# EAGLE design esp-core (EAGLE 7.3.0)
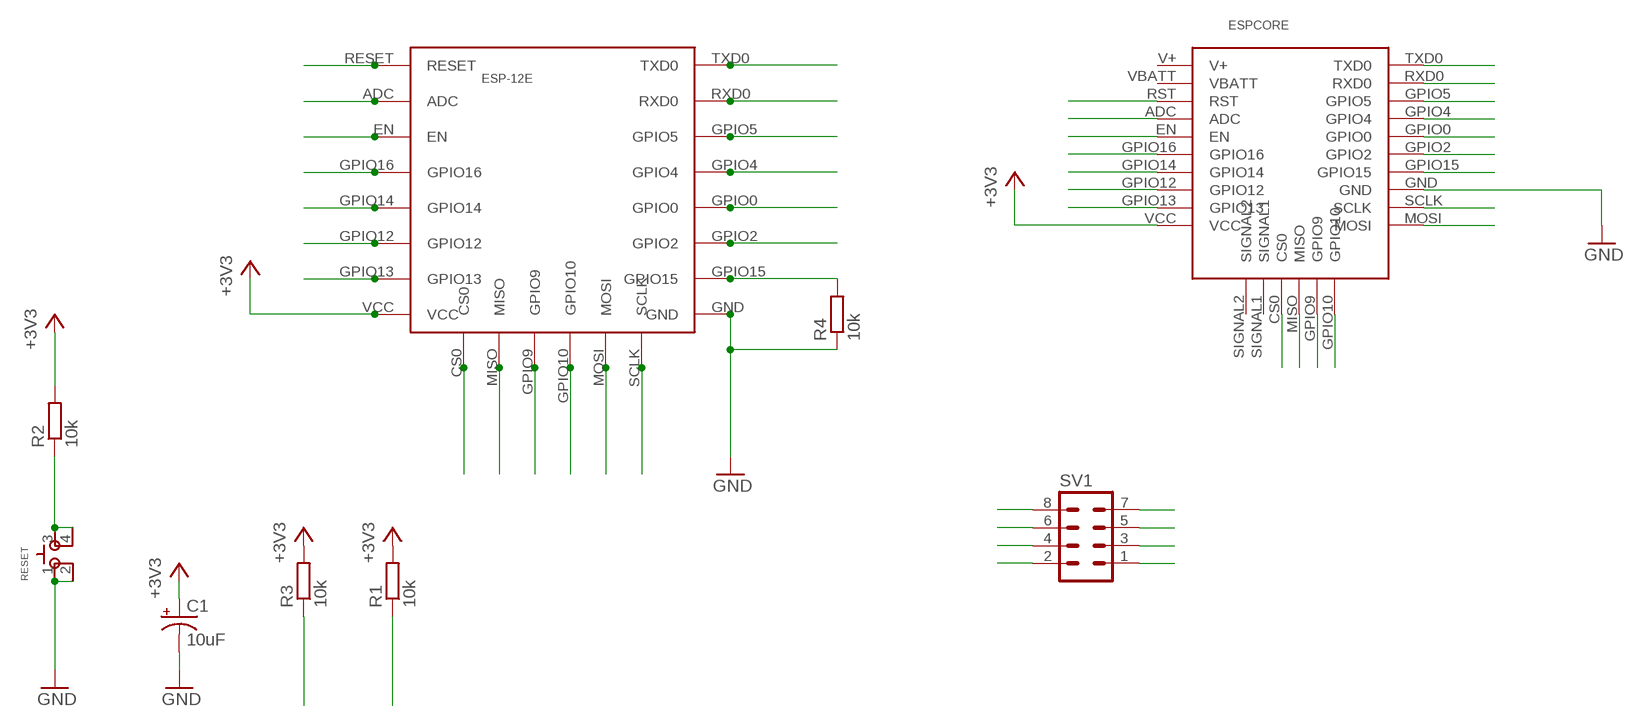
[diagram p0: schematic, sheet 1]

## Parts
C1  10uF  10UF-16V-10%(TANT)  [EIA3216]
ESP-12E  ESP-12E  [ESP-12E]
ESPCORE  ESP-BOARD  [ESP-BOARD]
R1  10k  RESISTOR-1206  [R1206]
R2  10k  RESISTOR-1206  [R1206]
R3  10k  RESISTOR-1206  [R1206]
R4  10k  RESISTOR-1206  [R1206]
RESET  SKSCLDE010  [SKSCLDE010]
SV1  MA04-2  [MA04-2]

## Nets
+3V3: C1.A(+) ESP-12E.VCC ESPCORE.VCC R1.2 R2.2 R3.2 SV1.7
ADC: ESP-12E.ADC ESPCORE.ADC
CS0: ESP-12E.CS0 ESPCORE.CS0
EN: ESP-12E.EN ESPCORE.EN R1.1 SV1.3
GND: C1.C(-) ESP-12E.GND ESPCORE.GND R4.1 RESET.1 RESET.2 SV1.2
GPIO0: ESP-12E.GPIO0 ESPCORE.GPIO0 R3.1 SV1.6
GPIO2: ESP-12E.GPIO2 ESPCORE.GPIO2 SV1.4
GPIO4: ESP-12E.GPIO4 ESPCORE.GPIO4
GPIO5: ESP-12E.GPIO5 ESPCORE.GPIO5
GPIO9: ESP-12E.GPIO9 ESPCORE.GPIO9
GPIO10: ESP-12E.GPIO10 ESPCORE.GPIO10
GPIO12: ESP-12E.GPIO12 ESPCORE.GPIO12
GPIO13: ESP-12E.GPIO13 ESPCORE.GPIO13
GPIO14: ESP-12E.GPIO14 ESPCORE.GPIO14
GPIO15: ESP-12E.GPIO15 ESPCORE.GPIO15 R4.2
GPIO16: ESP-12E.GPIO16 ESPCORE.GPIO16
MISO: ESP-12E.MISO ESPCORE.MISO
MOSI: ESP-12E.MOSI ESPCORE.MOSI
RESET: ESP-12E.RESET ESPCORE.RST R2.1 RESET.3 RESET.4 SV1.5
RXD0: ESP-12E.RXD0 ESPCORE.RXD0 SV1.8
SCLK: ESP-12E.SCLK ESPCORE.SCLK
TXD0: ESP-12E.TXD0 ESPCORE.TXD0 SV1.1
Unconnected: ESPCORE.SIGNAL1 ESPCORE.SIGNAL2

## Power pins joined to a net without a drawn wire
V+: ESPCORE.V+
VBATT: ESPCORE.VBATT

## Library data of the parts
C1 = SparkFun-Capacitors:10UF-16V-10%(TANT): CAP-00811 1206/EIA-3216 Tantalum capacitor; PROD_ID: CAP-00811
ESP-12E = ESPstack:ESP-12E
ESPCORE = ESPstack:ESP-BOARD: STANDARIZED ESP-STACK BOARD
R1-R4 = dp_devices:RESISTOR
RESET = ESPstack:SKSCLDE010
SV1 = con-lstb:MA04-2: PIN HEADER; OC_FARNELL: unknown; OC_NEWARK: unknown

## Board
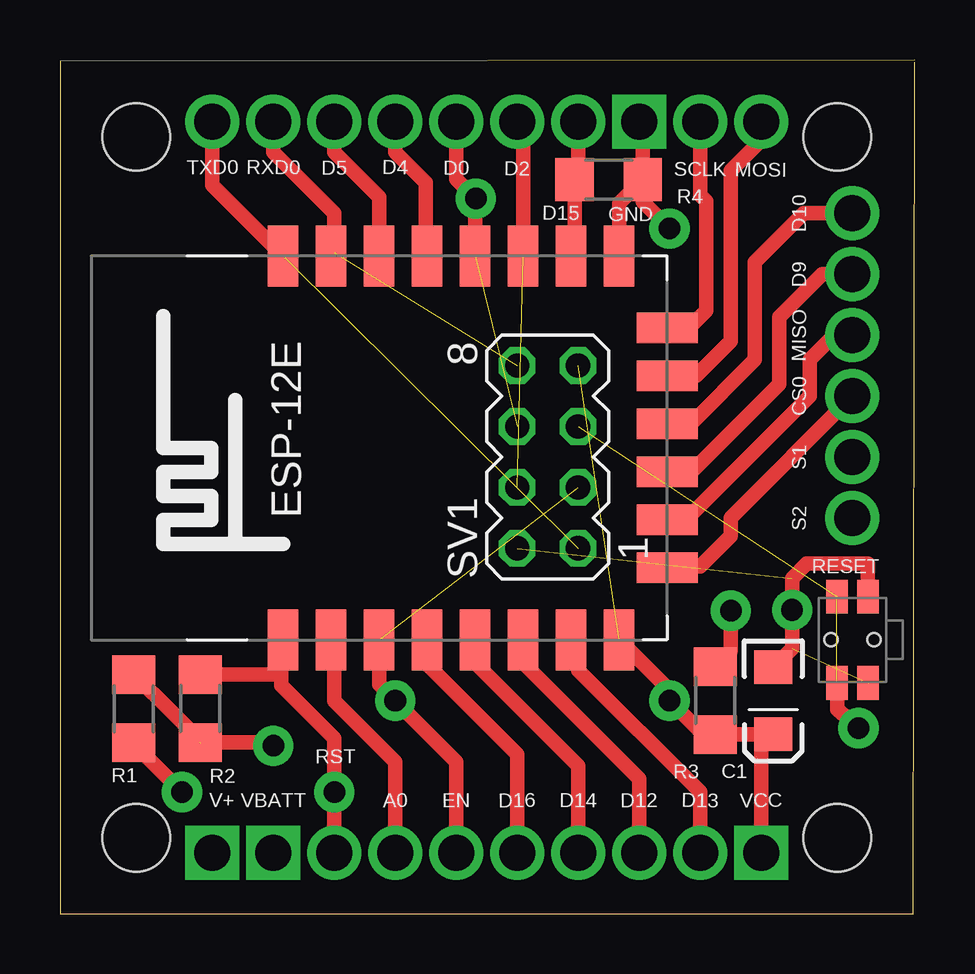
[diagram p1: board, top side]
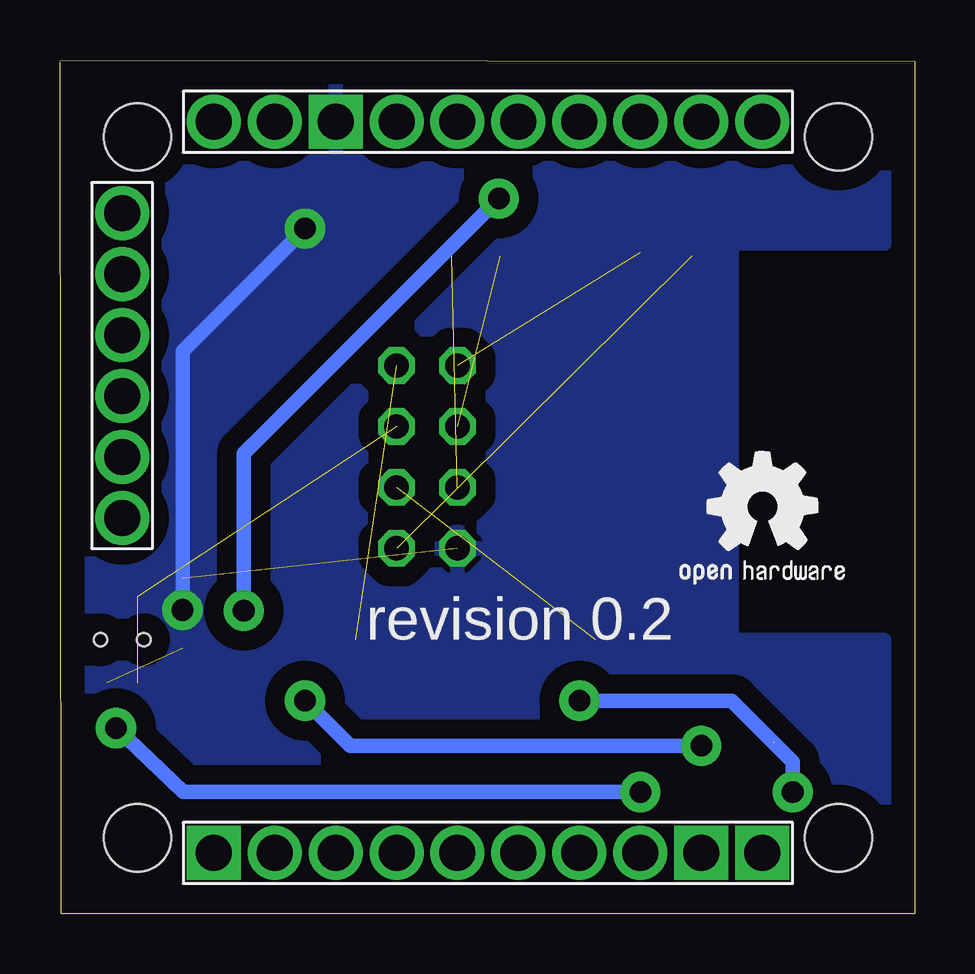
[diagram p2: board, bottom side, seen from below]

Size 35.61 x 35.6 mm. Coordinates in mm from the lower left corner, seen from the top.
Outline: 35.61,35.51 35.56,0 0,0 0,35.55 35.61,35.6
Copper layers (1*16): Top 0.0356mm / dielectric 1.5011mm / Bottom 0.0356mm
Design rules "LaenPCBOrder": minimum track width 6mil, minimum drill 13mil, track to track 6mil, track to pad 6mil, pad to pad 6mil, via to via 6mil, smd to smd 6mil, copper to edge 15mil, drill to drill 6mil, minimum pad ring 7mil, minimum via ring 7mil, stop-mask expansion 3mil, vias tented up to drill 0mil, thermal gap 10mil

### Footprints (pad centres in the part's own frame; a part is rotated, then mirrored left to right if it is on the bottom)
EIA3216 = smd 1.4 x 1.6: A 1.4,0; C -1.4,0
ESP-12E = smd 2.54 x 1.27: ADC 0,14; EN 0,12; GND 16,2; GPIO0 16,8; GPIO2 16,6; GPIO4 16,10; GPIO5 16,12; GPIO12 0,6; GPIO13 0,4; GPIO14 0,8; GPIO15 16,4; GPIO16 0,10; RESET 0,16; RXD0 16,14; TXD0 16,16; VCC 0,2 | smd 1.27 x 2.54: CS0 3,0; GPIO9 7,0; GPIO10 9,0; MISO 5,0; MOSI 11,0; SCLK 13,0
ESP-BOARD = drill 1.5 pad 2.184: ADC -10.16,-16.51; CS0 8.89,2.54; EN -7.62,-16.51; GPIO0 -7.62,13.97; GPIO2 -5.08,13.97; GPIO4 -10.16,13.97; GPIO5 -12.7,13.97; GPIO9 8.89,7.62; GPIO10 8.89,10.16; GPIO12 0,-16.51; GPIO13 2.54,-16.51; GPIO14 -2.54,-16.51; GPIO15 -2.54,13.97; GPIO16 -5.08,-16.51; MISO 8.89,5.08; MOSI 5.08,13.97; RST -12.7,-16.51; RXD0 -15.24,13.97; SCLK 2.54,13.97; SIGNAL1 8.89,0; SIGNAL2 8.89,-2.54; TXD0 -17.78,13.97 | drill 1.5 pad 2.184 square: GND 0,13.97; V+ -17.78,-16.51; VBATT -15.24,-16.51; VCC 5.08,-16.51 | hole 2.8: 8.255,13.335; -20.955,13.335; 8.255,-15.875; -20.955,-15.875
R1206 = smd 1.6 x 1.803: 1 -1.422,0; 2 1.422,0
SKSCLDE010 = smd 1.4 x 0.9: 1 -1.8,-0.65; 2 1.8,-0.65; 3 -1.8,0.65; 4 1.8,0.65 | hole 0.55: 0,0.9; 0,-0.9
MA04-2 = drill 1.016 octagon: 1 -3.81,-1.27; 2 -3.81,1.27; 3 -1.27,-1.27; 4 -1.27,1.27; 5 1.27,-1.27; 6 1.27,1.27; 7 3.81,-1.27; 8 3.81,1.27

### Placement (x,y rotation side)
C1  29.72,8.89 270 top
ESP-12E  25.3,11.43 90 top
ESPCORE  24.13,19.05 0 top
R1  3.07,8.56 90 top
R2  5.84,8.56 270 top
R3  27.3,8.89 270 top
R4  22.86,30.61 180 top
RESET  33.02,11.43 90 top
SV1  20.32,19.05 90 top
U$1  [OSHW2]  2.54,12.7 0 top

### Tracks (layer width: path | path; a pad name or v marks a point on that pad's centre or on a via)
+3V3  (via drill 0.9 pad 1.68)  (2 unrouted)
  Top 0.61: R2.2 5.84,7.24 3.89,9.2 3.86,9.2 R1.2 | ESP-12E.VCC 25.4,9.33 v25.4,8.89 26.82,7.47 R3.2 27.92,7.47 27.94,7.49 C1.A 29.21,6.98 ESPCORE.VCC | 5.87,7.16 8.74,7.16 v8.89,7.01
  Bottom 0.61: v8.89,7.01 23.52,7.01 v25.4,8.89
ADC
  Top 0.61: ESPCORE.ADC 13.97,6.35 11.43,8.89 11.43,11.3 ESP-12E.ADC
CS0
  Top 0.61: ESPCORE.CS0 27.94,16.51 27.94,15.75 26.67,14.48 25.35,14.48 ESP-12E.CS0
EN  (via drill 0.9 pad 1.68)  (1 unrouted)
  Top 0.61: R1.1 3.07,7.09 v5.08,5.08 | ESPCORE.EN 16.51,6.35 v13.97,8.89 13.3,9.56 ESP-12E.EN
  Bottom 0.61: v5.08,5.08 5.08,6.35 7.62,8.89 v13.97,8.89
GND  (via drill 0.9 pad 1.68)  (2 unrouted)
  Top 0.61: RESET.2 33.67,13.32 33.66,14.61 31.11,14.61 30.5,13.99 v30.5,12.68 30.5,11.08 C1.C | ESPCORE.GND 24.28,32.87 R4.1 | R4.1 23.3,29.62 ESP-12E.GND | R4.1 24.28,29.69 v25.4,28.57
  Bottom 0.61: v30.5,12.68 30.5,23.47 v25.4,28.57
  pour Bottom (isolate 0.813): 1.27,34.29 34.29,34.29 34.29,1.27 1.27,1.27 1.27,11.43 7.62,11.43 7.62,27.94 1.27,27.94
GPIO0  (via drill 0.9 pad 1.68)  (1 unrouted)
  Top 0.61: ESP-12E.GPIO0 17.3,29.79 v17.33,29.82 16.51,30.64 ESPCORE.GPIO0 | v27.95,12.64 27.95,10.96 R3.1
  Bottom 0.61: v27.95,12.64 27.95,19.2 v17.33,29.82
GPIO2  (1 unrouted)
  Top 0.61: ESPCORE.GPIO2 19.3,32.77 ESP-12E.GPIO2
GPIO4
  Top 0.61: ESPCORE.GPIO4 13.97,31.75 15.24,30.48 15.24,27.49 ESP-12E.GPIO4
GPIO5
  Top 0.61: ESP-12E.GPIO5 13.3,29.88 11.43,31.75 ESPCORE.GPIO5
GPIO9
  Top 0.61: ESP-12E.GPIO9 26.3,18.43 29.97,22.1 29.97,24.89 31.75,26.67 ESPCORE.GPIO9
GPIO10
  Top 0.61: ESP-12E.GPIO10 26.27,20.43 28.96,23.11 28.96,27.18 30.99,29.21 ESPCORE.GPIO10
GPIO12
  Top 0.61: ESPCORE.GPIO12 24.13,5.64 19.28,10.49 19.28,11.41 ESP-12E.GPIO12
GPIO13
  Top 0.61: ESPCORE.GPIO13 26.67,5.08 21.59,10.16 21.59,11.14 ESP-12E.GPIO13
GPIO14
  Top 0.61: ESPCORE.GPIO14 21.59,6.17 17.12,10.64 17.12,11.25 ESP-12E.GPIO14
GPIO15
  Top 0.61: ESP-12E.GPIO15 21.44,27.57 R4.2 21.59,30.76 ESPCORE.GPIO15
GPIO16
  Top 0.61: ESPCORE.GPIO16 19.05,6.66 15.27,10.44 15.27,11.4 ESP-12E.GPIO16
MISO
  Top 0.61: ESP-12E.MISO 26.08,16.43 31.24,21.59 31.24,23.11 32.26,24.13 ESPCORE.MISO
MOSI
  Top 0.61: ESP-12E.MOSI 26.49,22.43 27.94,23.88 27.94,30.99 29.21,32.26 ESPCORE.MOSI
RESET  (via drill 0.9 pad 1.68)  (2 unrouted)
  Top 0.61: RESET.3 32.38,8.53 v33.27,7.75 | ESPCORE.RST v11.43,5.08 11.43,7.32 9.22,9.53 9.22,10.16 | 9.22,10.16 9.22,11.35 ESP-12E.RESET | R2.1 9.04,9.98 9.22,10.16
  Bottom 0.61: v33.27,7.75 30.48,5.08 v11.43,5.08
RXD0  (1 unrouted)
  Top 0.61: ESPCORE.RXD0 8.89,31.75 11.43,29.21 11.43,27.56 ESP-12E.RXD0
SCLK
  Top 0.61: ESPCORE.SCLK 26.67,29.97 26.92,29.72 26.92,25.15 26.16,24.38 25.34,24.38 ESP-12E.SCLK
TXD0  (1 unrouted)
  Top 0.61: ESPCORE.TXD0 6.35,30.38 ESP-12E.TXD0

### Text on the board
tPlace: TXD0 | RXD0 | D5 | D4 | D0 | D2 | SCLK | MOSI | D15 | GND | D10 | D9 | MISO | CS0 | S1 | S2 | RST | V+ | VBATT | A0 | EN | D16 | D14 | D12 | D13 | VCC
bPlace: revision 0.2